# Altium schematic sheet [07] - NAND FLASH.SchDoc
size A4; DocumentNumber: 7; SheetNumber: 7; SheetTotal: 9
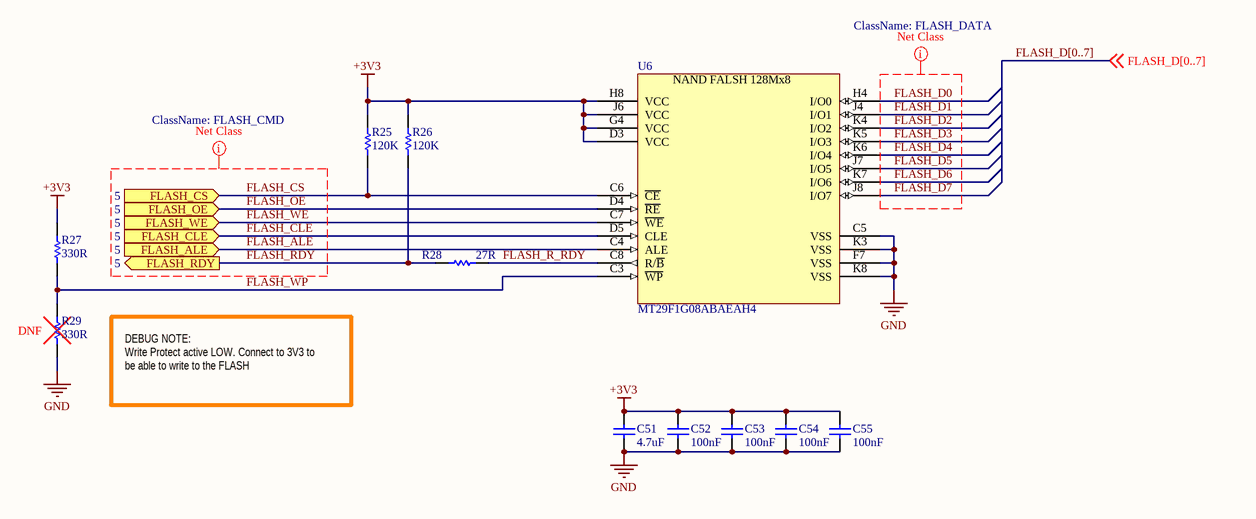
[diagram p0: [07] - NAND FLASH.SchDoc]

## Parts
C51  value 4.7uF  [CAP-0805]  (hidden comment: 885012107013)
C52  value 100nF  [CAP-0603]  (hidden comment: C0603C104M4RAC)
C53  value 100nF  [CAP-0603]  (hidden comment: C0603C104M4RAC)
C54  value 100nF  [CAP-0603]  (hidden comment: C0603C104M4RAC)
C55  value 100nF  [CAP-0603]  (hidden comment: C0603C104M4RAC)
R25  value 120K  [RES-0603]  (hidden comment: RT0603FRE07120KL)
R26  value 120K  [RES-0603]  (hidden comment: RT0603FRE07120KL)
R27  value 330R  [RES-0603]  (hidden comment: RT0603FRD07330RL)
R28  value 27R  [RES-0603]  (hidden comment: RT0603DRD0727RL)
R29  value 330R  [RES-0603]  (hidden comment: RT0603FRD07330RL)
U6  MT29F1G08ABAEAH4  [BGA0.8_FLASH_63_9X11]

## Ports
FLASH_ALE (in, see 5), FLASH_CLE (in, see 5), FLASH_CS (in, see 5), FLASH_OE (in, see 5), FLASH_RDY (out, see 5), FLASH_WE (in, see 5)

## Nets
+3V3: C51.2 C52.2 C53.2 C54.2 C55.2 R25.2 R26.2 R27.2 U6.D3(VCC) U6.G4(VCC) U6.H8(VCC) U6.J6(VCC)
GND: C51.1 C52.1 C53.1 C54.1 C55.1 R29.1 U6.C5(VSS) U6.F7(VSS) U6.K3(VSS) U6.K8(VSS)
FLASH_ALE: U6.C4(ALE) ; port FLASH_ALE
FLASH_CLE: U6.D5(CLE) ; port FLASH_CLE
FLASH_CS: R25.1 U6.C6(~{CE}) ; port FLASH_CS
FLASH_D0: U6.H4(I/O0)
FLASH_D1: U6.J4(I/O1)
FLASH_D2: U6.K4(I/O2)
FLASH_D3: U6.K5(I/O3)
FLASH_D4: U6.K6(I/O4)
FLASH_D5: U6.J7(I/O5)
FLASH_D6: U6.K7(I/O6)
FLASH_D7: U6.J8(I/O7)
FLASH_OE: U6.D4(~{RE}) ; port FLASH_OE
FLASH_R_RDY: R28.2 U6.C8(R/~{B})
FLASH_RDY: R26.1 R28.1 ; port FLASH_RDY
FLASH_WE: U6.C7(~{WE}) ; port FLASH_WE
FLASH_WP: R27.1 R29.2 U6.C3(~{WP})

## Buses and harness runs
bus FLASH_D[0..7]

## Layout directives
net class FLASH_CMD: FLASH_ALE, FLASH_CLE, FLASH_CS, FLASH_OE, FLASH_RDY, FLASH_WE
net class FLASH_DATA: FLASH_D0, FLASH_D1, FLASH_D2, FLASH_D3, FLASH_D4, FLASH_D5, FLASH_D6, FLASH_D7

## Notes on the sheet
- (near R29) DNF
- DEBUG NOTE:
  Write Protect active LOW. Connect to 3V3 to be able to write to the FLASH
- Title:
- Project:
- Sheet:
- Author:
- of
- Revision:
- Date:
- (in symbol MICRON-FLASH-MT29F1G08ABAEAH4) NAND FALSH 128Mx8

## Library data of the parts
C51 = CAP-0805-4.7u-885012107013_2: Multilayer Ceramic Capacitors MLCC - SMD/SMT WCAP-CSGP 4.7uF 0805 20% 16V MLCC; Manufacturer: Wurth Elektronik; Voltage Rating DC: 16 VDC; Supplier 1: Mouser; Supplier Part Number 1: 710-885012107013
C52-C55 = CAP-0603-100n-C0603C104M4RAC: Multilayer Ceramic Capacitors MLCC - SMD/SMT 16V 0.1uF X7R 0603 20%; Manufacturer: KEMET; Voltage Rating DC: 16 VDC; Supplier 1: Mouser; Supplier Part Number 1: 80-C0603C104M4RAC
R25 R26 = RES-0603-120K-RT0603FRE07120KL: Thin Film Resistors - SMD 1/10W 120K ohm 1% 50ppm; Manufacturer: Yageo; Supplier 1: Mouser; Supplier Part Number 1: 603-RT0603FRE07120KL
R27 R29 = RES-0603-330R-RT0603FRD07330RL: Thin Film Resistors - SMD 1/10W 330 ohm 1% 50ppm; Manufacturer: Yageo; Supplier 1: Mouser; Supplier Part Number 1: 603-RT0603FRD07330RL
R28 = RES-0603-27R-RT0603DRD0727RL: Thin Film Resistors - SMD 1/10W 27 ohm 1% 50ppm; Manufacturer: Yageo; Supplier 1: Mouser; Supplier Part Number 1: 603-RT0603DRD0727RL
U6 = MICRON-FLASH-MT29F1G08ABAEAH4: NAND Flash SLC 1G 128MX8 VFBGA-63; Supplier 1: Mouser; Supplier Part Number 1: 340-139663-TRAY